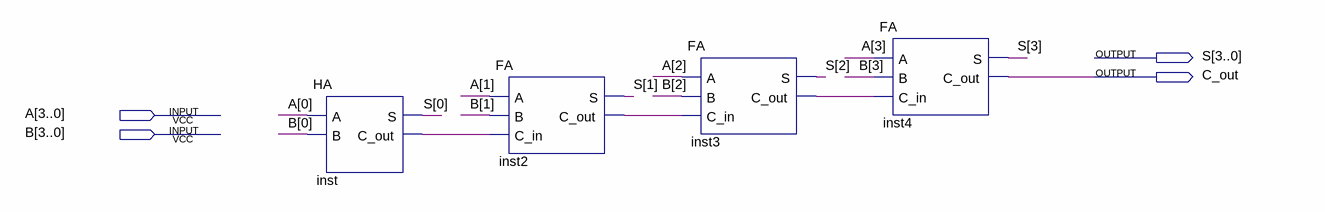
[diagram p0: schematic sheet]
// Quartus schematic RCA.bdf as structural Verilog: 4 symbols, 4 pins
module RCA (
  input  [3:0] A,
  input  [3:0] B,
  output [3:0] S,
  output C_out
);

  wire inst2_c_out, inst3_c_out, inst_c_out;

  HA inst (.A(A[0]), .B(B[0]), .S(S[0]), .C_out(inst_c_out));
  FA inst2 (.A(A[1]), .B(B[1]), .C_in(inst_c_out), .S(S[1]), .C_out(inst2_c_out));
  FA inst3 (.A(A[2]), .B(B[2]), .C_in(inst2_c_out), .S(S[2]), .C_out(inst3_c_out));
  FA inst4 (.A(A[3]), .B(B[3]), .C_in(inst3_c_out), .S(S[3]), .C_out(C_out));
endmodule
